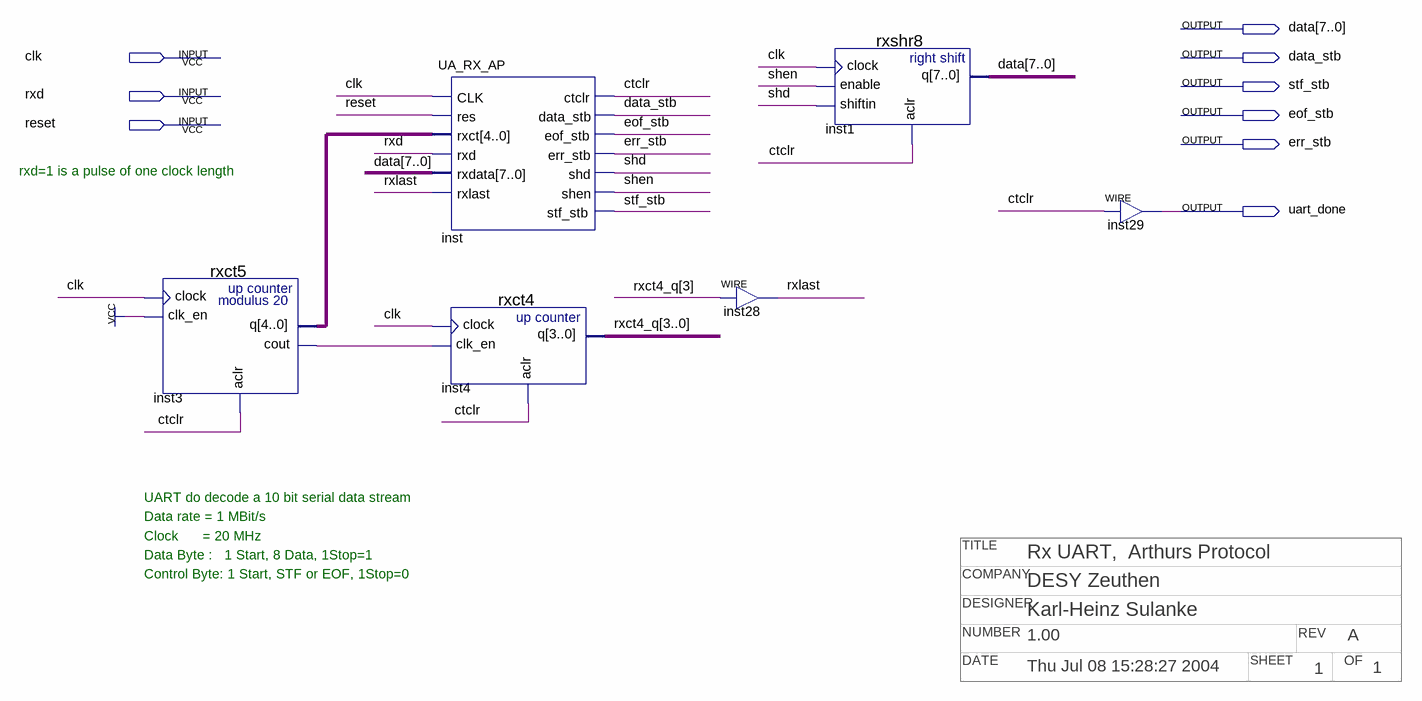
[diagram p0: schematic sheet]
// Quartus schematic RX_UART_ap.bdf as structural Verilog: 6 symbols, 9 pins
// Title block: TITLE: Rx UART,  Arthurs Protocol; COMPANY: DESY Zeuthen; DESIGNER: Karl-Heinz Sulanke; NUMBER: 1.00; REV: A; DATE: Thu Jul 08 15:28:27 2004; SHEET: 1; OF: 1
module RX_UART_ap (
  input  clk,
  input  rxd,
  input  reset,
  output [7:0] data,
  output data_stb,
  output stf_stb,
  output eof_stb,
  output err_stb,
  output uart_done
);

  wire ctclr, inst3_cout, rxlast, shd, shen;
  wire [3:0] rxct4_q;
  wire [4:0] inst3_q;

  rxct5 inst3 (.clock(clk), .clk_en(1'b1), .aclr(ctclr), .q(inst3_q), .cout(inst3_cout));
  UA_RX_AP inst (
    .CLK(clk), .res(reset), .rxct(inst3_q), .rxd(rxd), .rxdata(data), .rxlast(rxlast), .ctclr(ctclr),
    .data_stb(data_stb), .eof_stb(eof_stb), .err_stb(err_stb), .shd(shd), .shen(shen), .stf_stb(stf_stb));
  rxct4 inst4 (.clock(clk), .clk_en(inst3_cout), .aclr(ctclr), .q(rxct4_q));
  assign rxlast = rxct4_q[3];  // WIRE inst28
  rxshr8 inst1 (.clock(clk), .enable(shen), .shiftin(shd), .aclr(ctclr), .q(data));
  assign uart_done = ctclr;  // WIRE inst29

  // Notes on the sheet:
  //   rxd=1 is a pulse of one clock length
  //   UART do decode a 10 bit serial data stream
  //   Data rate = 1 MBit/s
  //   Clock      = 20 MHz
  //   Data Byte :   1 Start, 8 Data, 1Stop=1
  //   Control Byte: 1 Start, STF or EOF, 1Stop=0
endmodule
